# EAGLE design Blinds_Stepper (EAGLE 6.5.0)
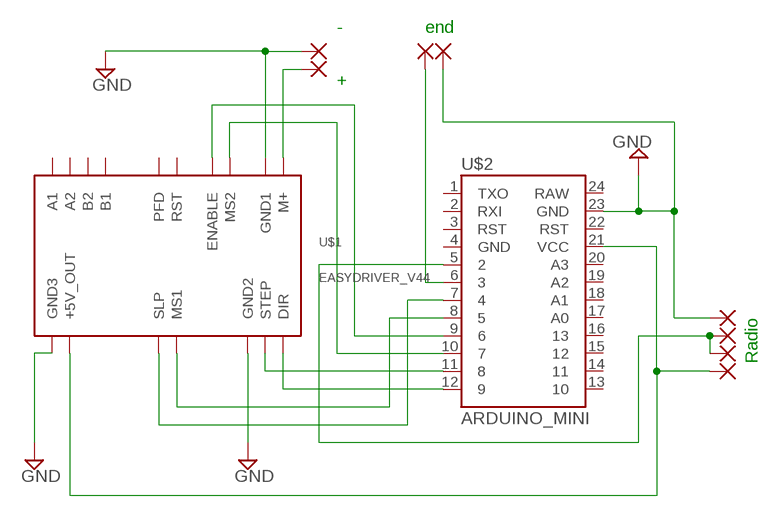
[diagram p0: schematic, sheet 1]

## Parts
E1  1,6/0,8  [1,6/0,8]
E2  1,6/0,8  [1,6/0,8]
M-  1,6/0,8  [1,6/0,8]
R1  1,6/0,8  [1,6/0,8]
R2  1,6/0,8  [1,6/0,8]
R+  1,6/0,8  [1,6/0,8]
R-  1,6/0,8  [1,6/0,8]
U$1  EASYDRIVER_V44  [EASYDRIVER_V44]
U$2  ARDUINO_MINI  [ARDUINO_MINI]
X  1,6/0,8  [1,6/0,8]

## Nets
GND: E2.1(P) M-.1(P) R-.1(P) U$1.GND1 U$1.GND2 U$1.GND3 U$2.23(GND)
N$1: U$1.M+ X.1(P)
N$2: U$1.DIR U$2.12
N$3: U$1.STEP U$2.11
N$4: U$1.ENABLE U$2.9
N$5: U$1.MS2 U$2.10
N$6: U$1.MS1 U$2.8
N$7: R+.1(P) U$1.P$11(+5V_OUT) U$2.21(VCC)
N$9: E1.1(P) U$2.6
N$12: R1.1(P) R2.1(P) U$2.5
N$14: U$1.SLEEP(SLP) U$2.7
Unconnected: U$1.A1 U$1.A2 U$1.B1 U$1.B2 U$1.PFD U$1.RST U$2.1(TXO) U$2.2(RXI) U$2.3(RST) U$2.4(GND) U$2.13 U$2.14 U$2.15 U$2.16 U$2.17(A0) U$2.18(A1) U$2.19(A2) U$2.20(A3) U$2.22(RST) U$2.24(RAW)

## Notes on the sheet
- - | end
- +
- Radio

## Library data of the parts
E1 E2 M- R1 R2 R+ R- X = wirepad:1,6/0,8: THROUGH-HOLE PAD
U$1 = EasyDriver:EASYDRIVER_V44: EasyDriver version 4.4 - http://www.schmalzhaus.com/EasyDriver
U$2 = SparkFun-Boards:ARDUINO_MINI: Arduino Pro Mini footprint

## Board
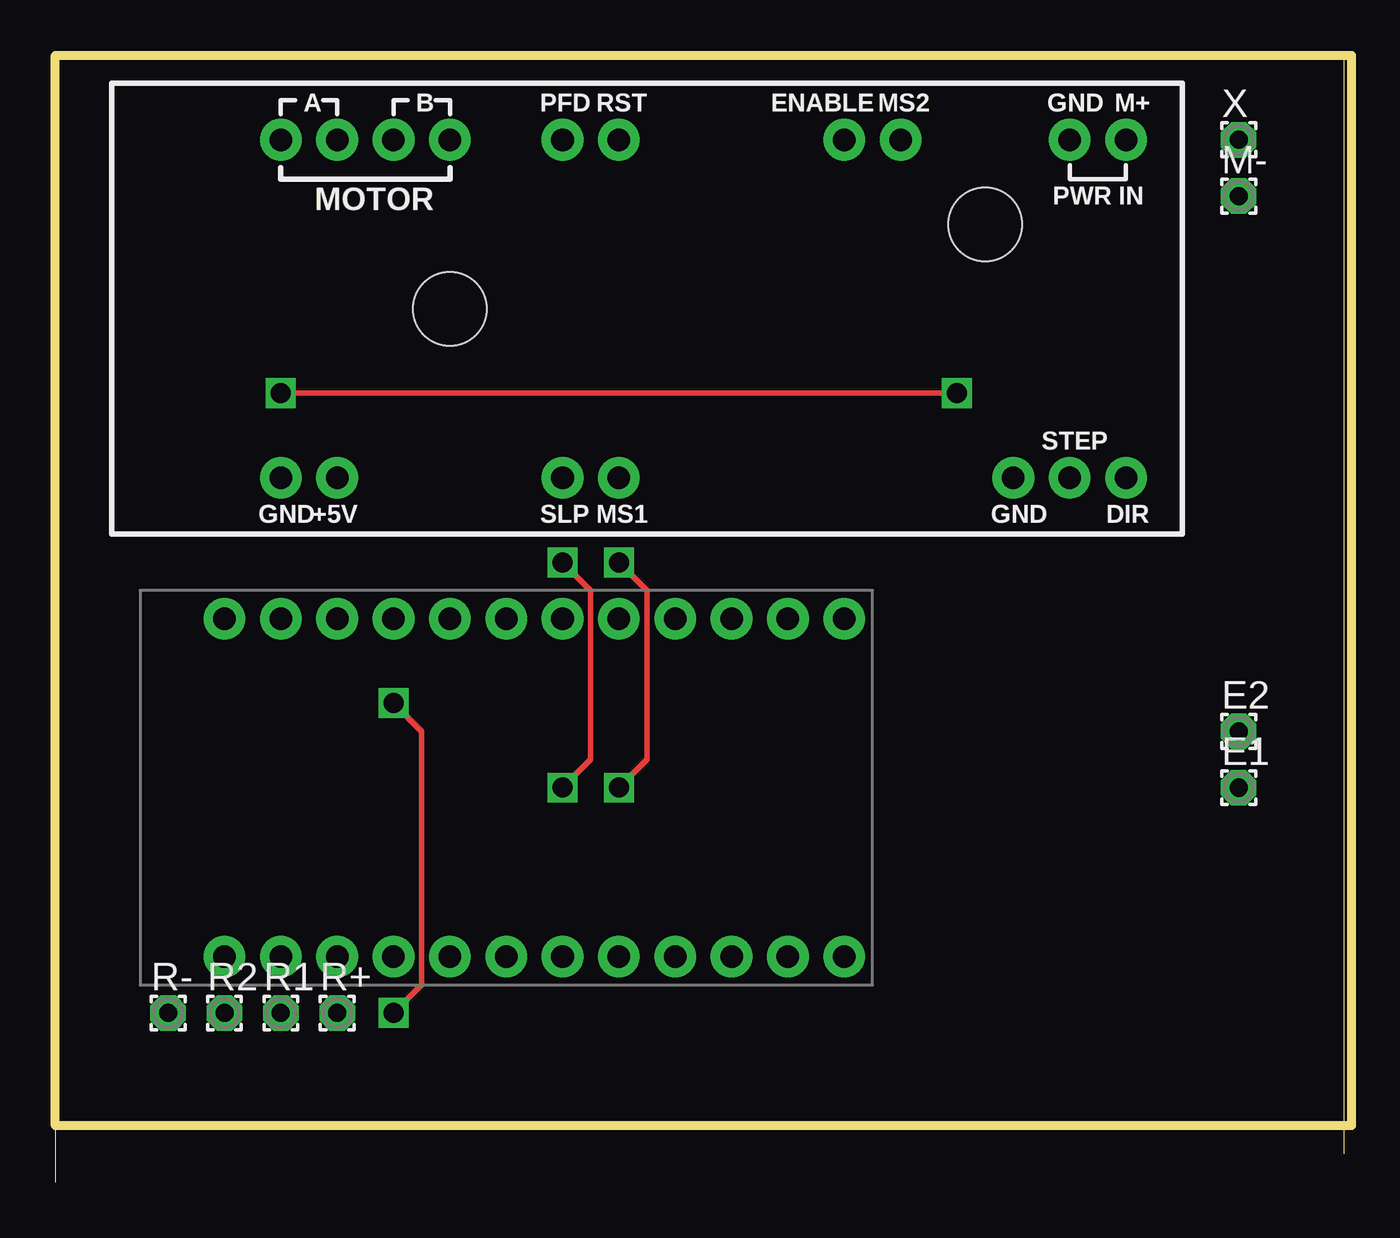
[diagram p1: board, top side]
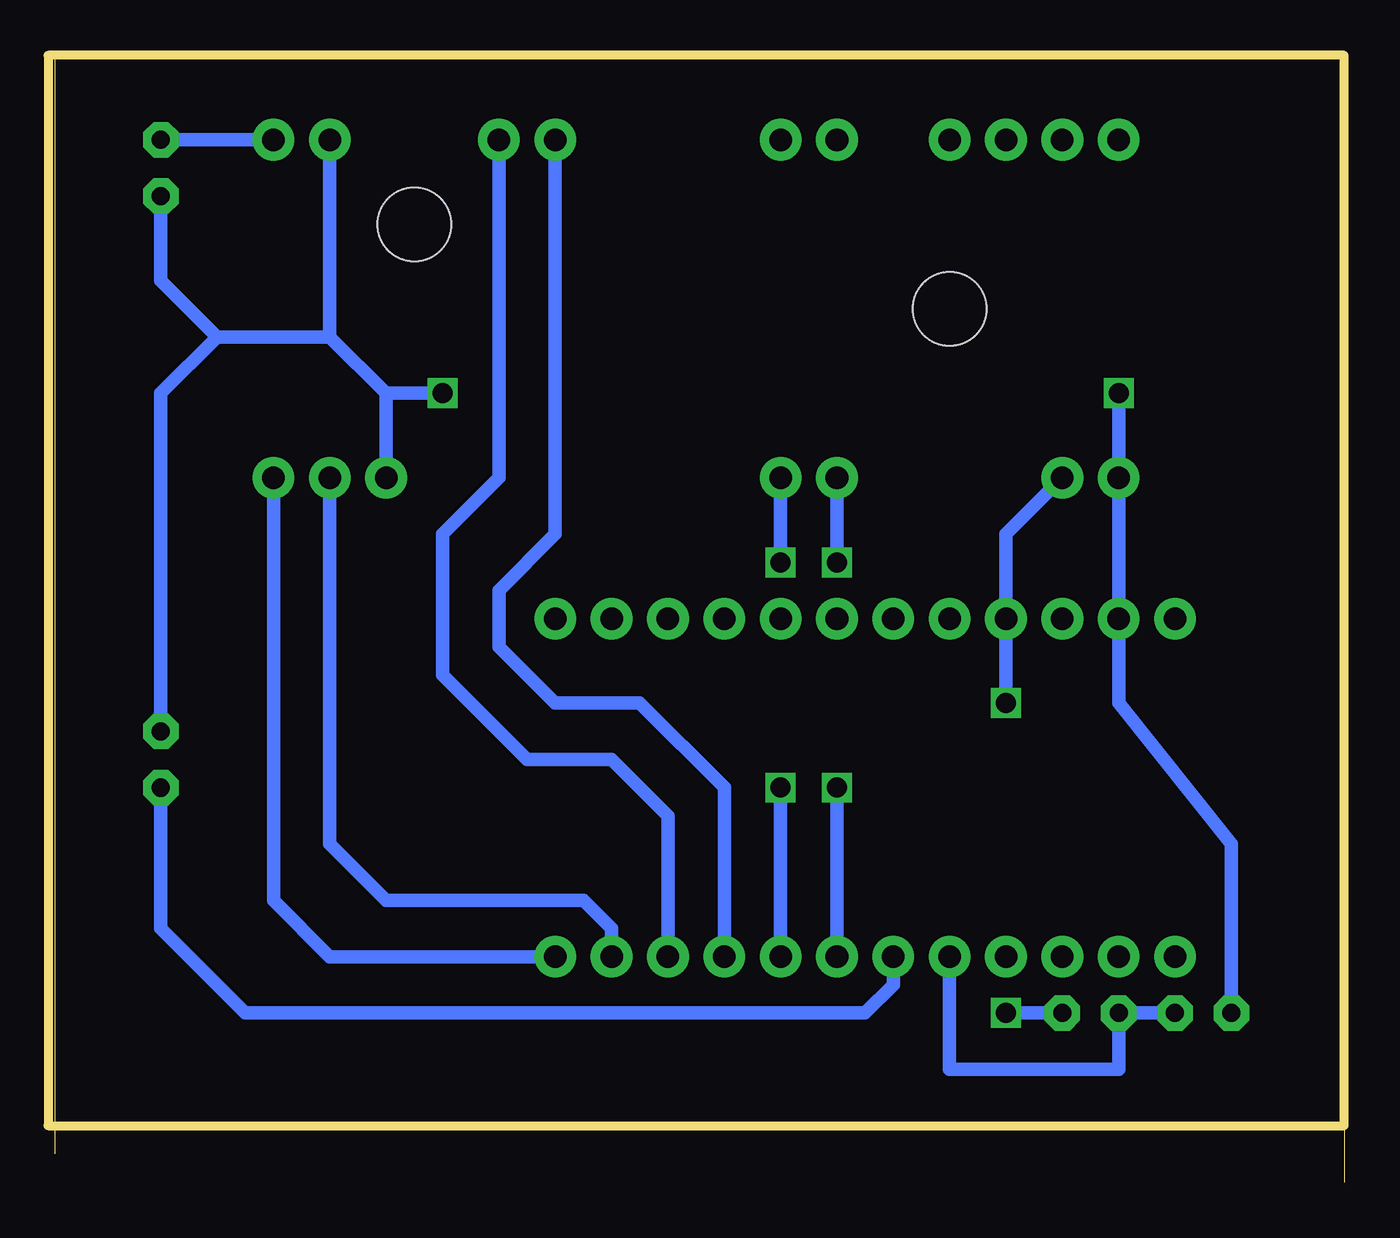
[diagram p2: board, bottom side, seen from below]

Size 58.09 x 50.79 mm. Coordinates in mm from the lower left corner, seen from the top.
Outline: 58.09,1.27 58.09,50.79 0,50.79 0,0
Copper layers (1*16): Top 0.035mm / dielectric 1.5mm / Bottom 0.035mm
Design rules "default": minimum track width 10mil, minimum drill 24mil, track to track 8mil, track to pad 8mil, pad to pad 8mil, via to via 8mil, smd to smd 8mil, copper to edge 40mil, drill to drill 8mil, minimum pad ring 10mil, minimum via ring 8mil, stop-mask expansion 4mil, vias tented up to drill 0mil, thermal gap 10mil
Milling: 4 lines

### Footprints (pad centres in the part's own frame; a part is rotated, then mirrored left to right if it is on the bottom)
1,6/0,8 = drill 0.813 pad 1.6 octagon: 1 0,0
EASYDRIVER_V44 = drill 1.016 pad 1.88: A1 -16.51,7.62; A2 -13.97,7.62; B1 -8.89,7.62; B2 -11.43,7.62; DIR 21.59,-7.62; ENABLE 8.89,7.62; GND1 19.05,7.62; GND2 16.51,-7.62; GND3 -16.51,-7.62; M+ 21.59,7.62; MS1 -1.27,-7.62; MS2 11.43,7.62; P$11 -13.97,-7.62; PFD -3.81,7.62; RST -1.27,7.62; SLEEP -3.81,-7.62; STEP 19.05,-7.62 | hole 3.302: 15.24,3.81; -8.89,0
ARDUINO_MINI = drill 1.016 pad 1.88: 1 -7.62,12.7; 2 -7.62,10.16; 3 -7.62,7.62; 4 -7.62,5.08; 5 -7.62,2.54; 6 -7.62,0; 7 -7.62,-2.54; 8 -7.62,-5.08; 9 -7.62,-7.62; 10 -7.62,-10.16; 11 -7.62,-12.7; 12 -7.62,-15.24; 13 7.62,-15.24; 14 7.62,-12.7; 15 7.62,-10.16; 16 7.62,-7.62; 17 7.62,-5.08; 18 7.62,-2.54; 19 7.62,0; 20 7.62,2.54; 21 7.62,5.08; 22 7.62,7.62; 23 7.62,10.16; 24 7.62,12.7

### Placement (x,y rotation side)
E1  53.34,17.78 0 top
E2  53.34,20.32 0 top
M-  53.34,44.45 0 top
R1  10.16,7.62 0 top
R2  7.62,7.62 0 top
R+  12.7,7.62 0 top
R-  5.08,7.62 0 top
U$1  26.67,39.37 0 top
U$2  20.32,17.78 90 top
X  53.34,46.99 0 top

### Tracks (layer width: path | path; a pad name or v marks a point on that pad's centre or on a via)
GND  (via drill 0.9)
  Top 0.25: v10.16,35.56 v40.64,35.56
  Bottom 0.61: U$1.GND2 43.18,35.56 | 43.18,35.56 45.72,38.1 | 45.72,38.1 U$1.GND1 | 45.72,38.1 50.8,38.1 | 50.8,38.1 53.34,40.64 M-.1 | E2.1 53.34,35.56 50.8,38.1 | v10.16,35.56 U$1.GND3 U$2.23 10.16,21.59 5.08,15.24 R-.1 | 43.18,35.56 v40.64,35.56
N$1
  Bottom 0.61: U$1.M+ X.1
N$2
  Bottom 0.61: U$1.DIR 48.26,12.7 45.72,10.16 U$2.12
N$3
  Bottom 0.61: U$2.11 33.02,11.43 34.29,12.7 43.18,12.7 45.72,15.24 U$1.STEP
N$4
  Bottom 0.61: U$2.9 27.94,17.78 31.75,21.59 35.56,21.59 38.1,24.13 38.1,26.67 35.56,29.21 U$1.ENABLE
N$5
  Bottom 0.61: U$1.MS2 38.1,31.75 40.64,29.21 40.64,22.86 36.83,19.05 33.02,19.05 30.48,16.51 U$2.10
N$6  (via drill 0.9)
  Top 0.25: v25.4,17.78 26.67,19.05 26.67,26.67 v25.4,27.94
  Bottom 0.61: U$2.8 v25.4,17.78 | U$1.MS1 v25.4,27.94
N$7  (via drill 0.9)
  Top 0.25: v15.24,7.62 16.51,8.89 16.51,20.32 v15.24,21.59
  Bottom 0.61: U$1.P$11 15.24,29.21 U$2.21 v15.24,21.59 | R+.1 v15.24,7.62
N$9
  Bottom 0.61: U$2.6 20.32,8.89 21.59,7.62 49.53,7.62 53.34,11.43 E1.1
N$12
  Bottom 0.61: U$2.5 17.78,5.08 10.16,5.08 R1.1 R2.1
N$14  (via drill 0.9)
  Top 0.25: v22.86,17.78 24.13,19.05 24.13,26.67 v22.86,27.94
  Bottom 0.61: U$2.7 v22.86,17.78 | U$1.SLEEP v22.86,27.94